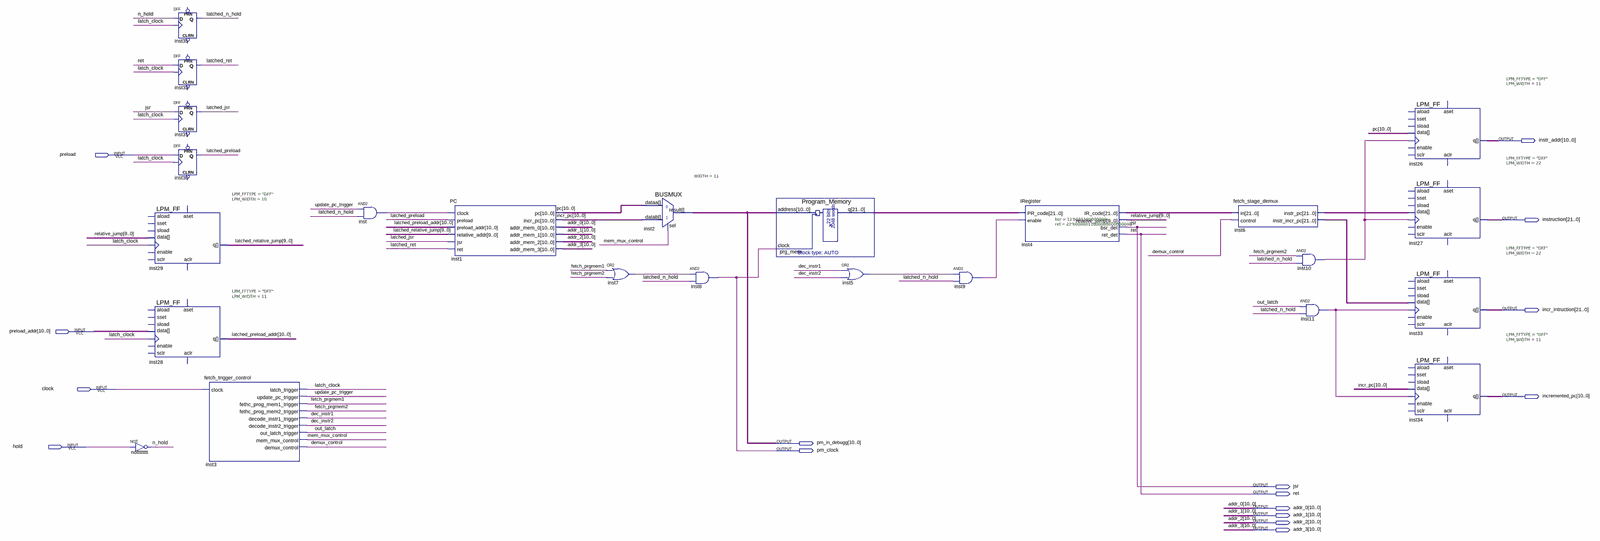
[diagram p0: schematic sheet, whole]
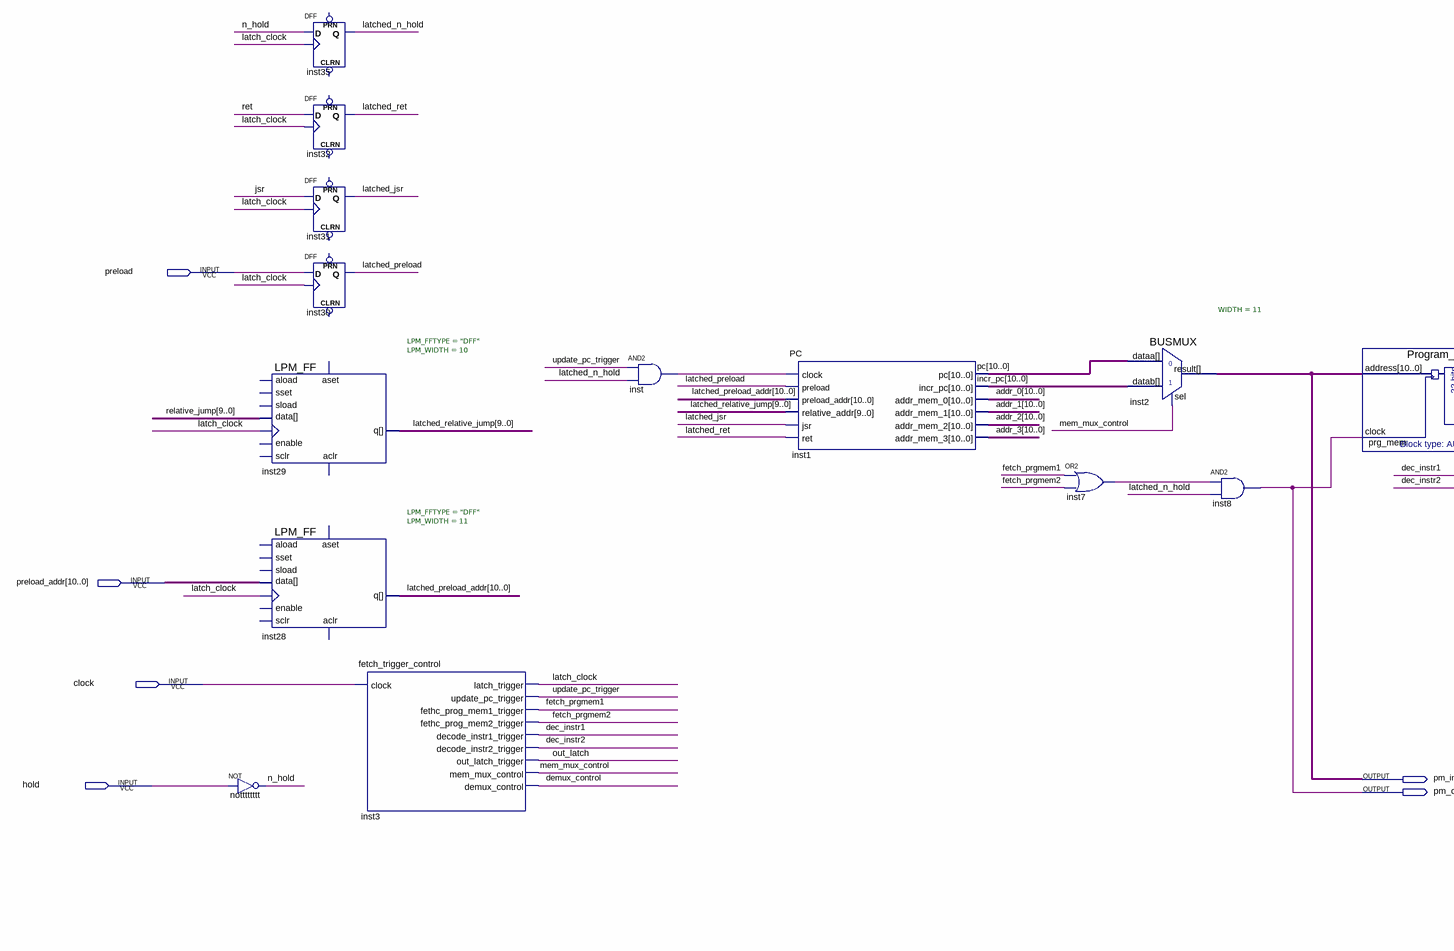
[diagram p1: schematic sheet, left part]
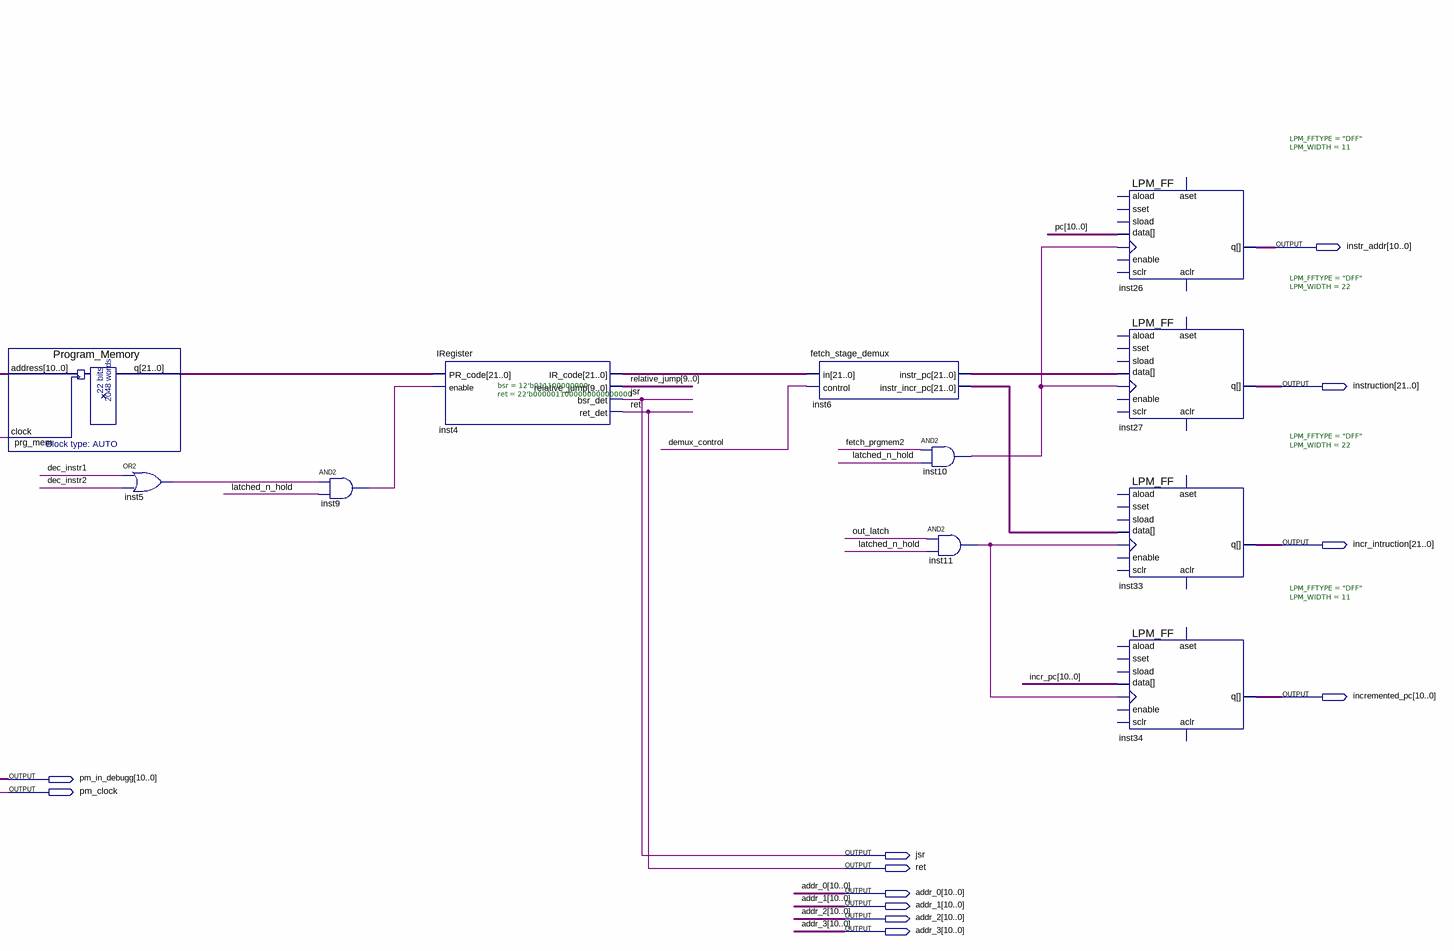
[diagram p2: schematic sheet, right part]
// Quartus schematic fetch_stage.bdf as structural Verilog: 24 symbols, 16 pins
module fetch_stage (
  input  preload,
  input  [10:0] preload_addr,
  input  clock,
  input  hold,
  output [10:0] instr_addr,
  output [21:0] instruction,
  output [21:0] incr_intruction,
  output [10:0] incremented_pc,
  output [10:0] pm_in_debugg,
  output pm_clock,
  output jsr,
  output ret,
  output [10:0] addr_0,
  output [10:0] addr_1,
  output [10:0] addr_2,
  output [10:0] addr_3
);

  wire dec_instr1, dec_instr2, demux_control, fetch_prgmem1, fetch_prgmem2, inst5_out, inst7_out, inst9_out,
       inst10_out, inst11_out, inst_out, latch_clock, latched_jsr, latched_n_hold, latched_preload,
       latched_ret, mem_mux_control, n_hold, out_latch, update_pc_trigger;
  wire [9:0] latched_relative_jump, relative_jump;
  wire [10:0] incr_pc, latched_preload_addr, pc;
  wire [21:0] inst4_ir_code, inst6_instr_incr_pc, inst6_instr_pc, prg_mem_q;

  not notttttttt (n_hold, hold);
  LPM_FF #(.LPM_FFTYPE("DFF"), .LPM_WIDTH(10)) inst29 (
    .clock(latch_clock), .data(relative_jump), .q(latched_relative_jump));  // open: enable, aload, sset, sload, aset, sclr, aclr
  LPM_FF #(.LPM_FFTYPE("DFF"), .LPM_WIDTH(11)) inst28 (
    .clock(latch_clock), .data(preload_addr), .q(latched_preload_addr));  // open: enable, aload, sset, sload, aset, sclr, aclr
  DFF inst35 (.CLK(latch_clock), .D(n_hold), .Q(latched_n_hold));  // open: CLRN, PRN
  DFF inst32 (.CLK(latch_clock), .D(ret), .Q(latched_ret));  // open: CLRN, PRN
  DFF inst31 (.CLK(latch_clock), .D(jsr), .Q(latched_jsr));  // open: CLRN, PRN
  DFF inst30 (.CLK(latch_clock), .D(preload), .Q(latched_preload));  // open: CLRN, PRN
  fetch_trigger_control inst3 (
    .clock(clock), .latch_trigger(latch_clock), .update_pc_trigger(update_pc_trigger),
    .fethc_prog_mem1_trigger(fetch_prgmem1), .fethc_prog_mem2_trigger(fetch_prgmem2),
    .decode_instr1_trigger(dec_instr1), .decode_instr2_trigger(dec_instr2), .out_latch_trigger(out_latch),
    .mem_mux_control(mem_mux_control), .demux_control(demux_control));
  and inst (inst_out, update_pc_trigger, latched_n_hold);
  PC inst1 (
    .clock(inst_out), .preload(latched_preload), .preload_addr(latched_preload_addr),
    .relative_addr(latched_relative_jump), .jsr(latched_jsr), .ret(latched_ret), .pc(pc), .incr_pc(incr_pc),
    .addr_mem_0(addr_0), .addr_mem_1(addr_1), .addr_mem_2(addr_2), .addr_mem_3(addr_3));
  or inst7 (inst7_out, fetch_prgmem1, fetch_prgmem2);
  BUSMUX #(.WIDTH(11)) inst2 (.datab(incr_pc), .sel(mem_mux_control), .dataa(pc), .result(pm_in_debugg));
  and inst8 (pm_clock, inst7_out, latched_n_hold);
  Program_Memory prg_mem (.address(pm_in_debugg), .clock(pm_clock), .q(prg_mem_q));
  or inst5 (inst5_out, dec_instr1, dec_instr2);
  and inst9 (inst9_out, inst5_out, latched_n_hold);
  IRegister #(.bsr(12'b011100000000), .ret(22'b0000011000000000000000)) inst4 (
    .PR_code(prg_mem_q), .enable(inst9_out), .IR_code(inst4_ir_code), .relative_jump(relative_jump),
    .bsr_det(jsr), .ret_det(ret));
  fetch_stage_demux inst6 (
    .in(inst4_ir_code), .control(demux_control), .instr_pc(inst6_instr_pc),
    .instr_incr_pc(inst6_instr_incr_pc));
  and inst10 (inst10_out, fetch_prgmem2, latched_n_hold);
  and inst11 (inst11_out, out_latch, latched_n_hold);
  LPM_FF #(.LPM_FFTYPE("DFF"), .LPM_WIDTH(11)) inst26 (
    .clock(inst10_out), .data(pc), .q(instr_addr));  // open: enable, aload, sset, sload, aset, sclr, aclr
  LPM_FF #(.LPM_FFTYPE("DFF"), .LPM_WIDTH(22)) inst27 (
    .clock(inst10_out), .data(inst6_instr_pc), .q(instruction));  // open: enable, aload, sset, sload, aset, sclr, aclr
  LPM_FF #(.LPM_FFTYPE("DFF"), .LPM_WIDTH(22)) inst33 (
    .clock(inst11_out), .data(inst6_instr_incr_pc), .q(incr_intruction));  // open: enable, aload, sset, sload, aset, sclr, aclr
  LPM_FF #(.LPM_FFTYPE("DFF"), .LPM_WIDTH(11)) inst34 (
    .clock(inst11_out), .data(incr_pc), .q(incremented_pc));  // open: enable, aload, sset, sload, aset, sclr, aclr
endmodule
